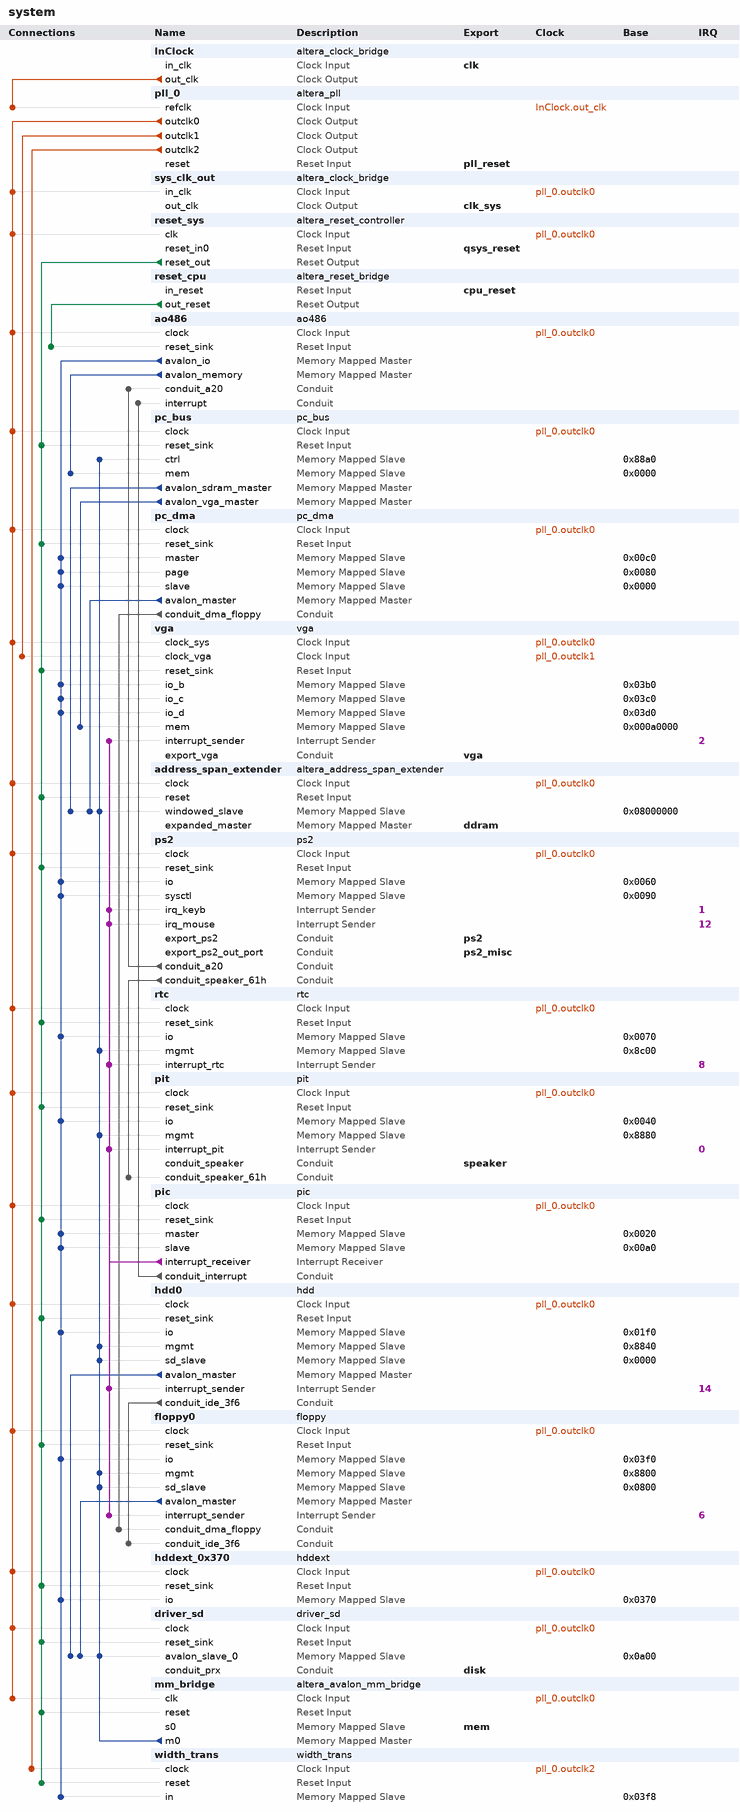
[diagram p0: system contents]
# Platform Designer (Qsys) system system, Cyclone V 5CSEMA5F31C6
# Parameters at their usual value, and those the tool derives, are not listed.
package require -exact qsys 17.0
create_system system
set_project_property DEVICE_FAMILY {Cyclone V}
set_project_property DEVICE 5CSEMA5F31C6

add_instance InClock altera_clock_bridge 17.0
set_instance_parameter_value InClock DERIVED_CLOCK_RATE 0
set_instance_parameter_value InClock EXPLICIT_CLOCK_RATE 50000000

add_instance pll_0 altera_pll 17.0
set_instance_parameter_value pll_0 gui_device_speed_grade 1
set_instance_parameter_value pll_0 gui_number_of_clocks 3
set_instance_parameter_value pll_0 gui_operation_mode direct
set_instance_parameter_value pll_0 gui_output_clock_frequency0 90.5
set_instance_parameter_value pll_0 gui_output_clock_frequency1 26.0
set_instance_parameter_value pll_0 gui_output_clock_frequency2 1.8432
set_instance_parameter_value pll_0 gui_pll_auto_reset On
set_instance_parameter_value pll_0 gui_pll_mode {Integer-N PLL}
set_instance_parameter_value pll_0 gui_reference_clock_frequency 50.0
set_instance_parameter_value pll_0 gui_use_locked false

add_instance sys_clk_out altera_clock_bridge 17.0
set_instance_parameter_value sys_clk_out DERIVED_CLOCK_RATE 90500000
set_instance_parameter_value sys_clk_out EXPLICIT_CLOCK_RATE 0

add_instance reset_sys altera_reset_controller 17.0
set_instance_parameter_value reset_sys NUM_RESET_INPUTS 1
set_instance_parameter_value reset_sys SYNC_DEPTH 2

add_instance reset_cpu altera_reset_bridge 17.0
set_instance_parameter_value reset_cpu ACTIVE_LOW_RESET 0
set_instance_parameter_value reset_cpu SYNCHRONOUS_EDGES none

add_instance ao486 ao486 1.0

add_instance pc_bus pc_bus 1.0

add_instance pc_dma pc_dma 1.0

add_instance vga vga 1.0

add_instance address_span_extender altera_address_span_extender 17.0
set_instance_parameter_value address_span_extender BURSTCOUNT_WIDTH 8
set_instance_parameter_value address_span_extender DATA_WIDTH 64
set_instance_parameter_value address_span_extender ENABLE_SLAVE_PORT false
set_instance_parameter_value address_span_extender MASTER_ADDRESS_DEF 805306368
set_instance_parameter_value address_span_extender MAX_PENDING_READS 8
set_instance_parameter_value address_span_extender SLAVE_ADDRESS_WIDTH 24

add_instance ps2 ps2 1.0

add_instance rtc rtc 1.0

add_instance pit pit 1.0

add_instance pic pic 1.0

add_instance hdd0 hdd 1.0
set_instance_parameter_value hdd0 BufAddress 0

add_instance floppy0 floppy 1.0
set_instance_parameter_value floppy0 BufAddress 2048

add_instance hddext_0x370 hddext 1.0

add_instance driver_sd driver_sd 2.0

add_instance mm_bridge altera_avalon_mm_bridge 17.0
set_instance_parameter_value mm_bridge ADDRESS_UNITS SYMBOLS
set_instance_parameter_value mm_bridge ADDRESS_WIDTH 32
set_instance_parameter_value mm_bridge DATA_WIDTH 32
set_instance_parameter_value mm_bridge MAX_PENDING_RESPONSES 4
set_instance_parameter_value mm_bridge USE_AUTO_ADDRESS_WIDTH 0

add_instance width_trans width_trans 17.0

# connections
add_connection InClock.out_clk pll_0.refclk clock
add_connection pll_0.outclk0 address_span_extender.clock clock
add_connection pll_0.outclk0 ao486.clock clock
add_connection pll_0.outclk0 driver_sd.clock clock
add_connection pll_0.outclk0 floppy0.clock clock
add_connection pll_0.outclk0 hdd0.clock clock
add_connection pll_0.outclk0 hddext_0x370.clock clock
add_connection pll_0.outclk0 mm_bridge.clk clock
add_connection pll_0.outclk0 pc_bus.clock clock
add_connection pll_0.outclk0 pc_dma.clock clock
add_connection pll_0.outclk0 pic.clock clock
add_connection pll_0.outclk0 pit.clock clock
add_connection pll_0.outclk0 ps2.clock clock
add_connection pll_0.outclk0 reset_sys.clk clock
add_connection pll_0.outclk0 rtc.clock clock
add_connection pll_0.outclk0 sys_clk_out.in_clk clock
add_connection pll_0.outclk0 vga.clock_sys clock
add_connection pll_0.outclk1 vga.clock_vga clock
add_connection pll_0.outclk2 width_trans.clock clock
add_connection reset_cpu.out_reset ao486.reset_sink reset
add_connection reset_sys.reset_out address_span_extender.reset reset
add_connection reset_sys.reset_out driver_sd.reset_sink reset
add_connection reset_sys.reset_out floppy0.reset_sink reset
add_connection reset_sys.reset_out hdd0.reset_sink reset
add_connection reset_sys.reset_out hddext_0x370.reset_sink reset
add_connection reset_sys.reset_out mm_bridge.reset reset
add_connection reset_sys.reset_out pc_bus.reset_sink reset
add_connection reset_sys.reset_out pc_dma.reset_sink reset
add_connection reset_sys.reset_out pic.reset_sink reset
add_connection reset_sys.reset_out pit.reset_sink reset
add_connection reset_sys.reset_out ps2.reset_sink reset
add_connection reset_sys.reset_out rtc.reset_sink reset
add_connection reset_sys.reset_out vga.reset_sink reset
add_connection reset_sys.reset_out width_trans.reset reset
add_connection ao486.avalon_io floppy0.io avalon
set_connection_parameter_value ao486.avalon_io/floppy0.io baseAddress 0x03f0
add_connection ao486.avalon_io hdd0.io avalon
set_connection_parameter_value ao486.avalon_io/hdd0.io baseAddress 0x01f0
add_connection ao486.avalon_io hddext_0x370.io avalon
set_connection_parameter_value ao486.avalon_io/hddext_0x370.io baseAddress 0x0370
add_connection ao486.avalon_io pc_dma.master avalon
set_connection_parameter_value ao486.avalon_io/pc_dma.master baseAddress 0x00c0
add_connection ao486.avalon_io pc_dma.page avalon
set_connection_parameter_value ao486.avalon_io/pc_dma.page baseAddress 0x0080
add_connection ao486.avalon_io pc_dma.slave avalon
set_connection_parameter_value ao486.avalon_io/pc_dma.slave baseAddress 0x0000
add_connection ao486.avalon_io pic.master avalon
set_connection_parameter_value ao486.avalon_io/pic.master baseAddress 0x0020
add_connection ao486.avalon_io pic.slave avalon
set_connection_parameter_value ao486.avalon_io/pic.slave baseAddress 0x00a0
add_connection ao486.avalon_io pit.io avalon
set_connection_parameter_value ao486.avalon_io/pit.io baseAddress 0x0040
add_connection ao486.avalon_io ps2.io avalon
set_connection_parameter_value ao486.avalon_io/ps2.io baseAddress 0x0060
add_connection ao486.avalon_io ps2.sysctl avalon
set_connection_parameter_value ao486.avalon_io/ps2.sysctl baseAddress 0x0090
add_connection ao486.avalon_io rtc.io avalon
set_connection_parameter_value ao486.avalon_io/rtc.io baseAddress 0x0070
add_connection ao486.avalon_io vga.io_b avalon
set_connection_parameter_value ao486.avalon_io/vga.io_b baseAddress 0x03b0
add_connection ao486.avalon_io vga.io_c avalon
set_connection_parameter_value ao486.avalon_io/vga.io_c baseAddress 0x03c0
add_connection ao486.avalon_io vga.io_d avalon
set_connection_parameter_value ao486.avalon_io/vga.io_d baseAddress 0x03d0
add_connection ao486.avalon_io width_trans.in avalon
set_connection_parameter_value ao486.avalon_io/width_trans.in baseAddress 0x03f8
add_connection ao486.avalon_memory pc_bus.mem avalon
set_connection_parameter_value ao486.avalon_memory/pc_bus.mem baseAddress 0x0000
add_connection floppy0.avalon_master driver_sd.avalon_slave_0 avalon
set_connection_parameter_value floppy0.avalon_master/driver_sd.avalon_slave_0 baseAddress 0x0a00
add_connection hdd0.avalon_master driver_sd.avalon_slave_0 avalon
set_connection_parameter_value hdd0.avalon_master/driver_sd.avalon_slave_0 baseAddress 0x0a00
add_connection mm_bridge.m0 address_span_extender.windowed_slave avalon
set_connection_parameter_value mm_bridge.m0/address_span_extender.windowed_slave baseAddress 0x08000000
add_connection mm_bridge.m0 driver_sd.avalon_slave_0 avalon
set_connection_parameter_value mm_bridge.m0/driver_sd.avalon_slave_0 baseAddress 0x0a00
add_connection mm_bridge.m0 floppy0.mgmt avalon
set_connection_parameter_value mm_bridge.m0/floppy0.mgmt baseAddress 0x8800
add_connection mm_bridge.m0 floppy0.sd_slave avalon
set_connection_parameter_value mm_bridge.m0/floppy0.sd_slave baseAddress 0x0800
add_connection mm_bridge.m0 hdd0.mgmt avalon
set_connection_parameter_value mm_bridge.m0/hdd0.mgmt baseAddress 0x8840
add_connection mm_bridge.m0 hdd0.sd_slave avalon
set_connection_parameter_value mm_bridge.m0/hdd0.sd_slave baseAddress 0x0000
add_connection mm_bridge.m0 pc_bus.ctrl avalon
set_connection_parameter_value mm_bridge.m0/pc_bus.ctrl baseAddress 0x88a0
add_connection mm_bridge.m0 pit.mgmt avalon
set_connection_parameter_value mm_bridge.m0/pit.mgmt baseAddress 0x8880
add_connection mm_bridge.m0 rtc.mgmt avalon
set_connection_parameter_value mm_bridge.m0/rtc.mgmt baseAddress 0x8c00
add_connection pc_bus.avalon_sdram_master address_span_extender.windowed_slave avalon
set_connection_parameter_value pc_bus.avalon_sdram_master/address_span_extender.windowed_slave baseAddress 0x08000000
add_connection pc_bus.avalon_vga_master vga.mem avalon
set_connection_parameter_value pc_bus.avalon_vga_master/vga.mem baseAddress 0x000a0000
add_connection pc_dma.avalon_master address_span_extender.windowed_slave avalon
set_connection_parameter_value pc_dma.avalon_master/address_span_extender.windowed_slave baseAddress 0x08000000
add_connection hdd0.conduit_ide_3f6 floppy0.conduit_ide_3f6 conduit
add_connection pc_dma.conduit_dma_floppy floppy0.conduit_dma_floppy conduit
add_connection pic.conduit_interrupt ao486.interrupt conduit
add_connection ps2.conduit_a20 ao486.conduit_a20 conduit
add_connection ps2.conduit_speaker_61h pit.conduit_speaker_61h conduit
add_connection pic.interrupt_receiver floppy0.interrupt_sender interrupt
set_connection_parameter_value pic.interrupt_receiver/floppy0.interrupt_sender irqNumber 6
add_connection pic.interrupt_receiver hdd0.interrupt_sender interrupt
set_connection_parameter_value pic.interrupt_receiver/hdd0.interrupt_sender irqNumber 14
add_connection pic.interrupt_receiver pit.interrupt_pit interrupt
set_connection_parameter_value pic.interrupt_receiver/pit.interrupt_pit irqNumber 0
add_connection pic.interrupt_receiver ps2.irq_keyb interrupt
set_connection_parameter_value pic.interrupt_receiver/ps2.irq_keyb irqNumber 1
add_connection pic.interrupt_receiver ps2.irq_mouse interrupt
set_connection_parameter_value pic.interrupt_receiver/ps2.irq_mouse irqNumber 12
add_connection pic.interrupt_receiver rtc.interrupt_rtc interrupt
set_connection_parameter_value pic.interrupt_receiver/rtc.interrupt_rtc irqNumber 8
add_connection pic.interrupt_receiver vga.interrupt_sender interrupt
set_connection_parameter_value pic.interrupt_receiver/vga.interrupt_sender irqNumber 2

# exported interfaces
add_interface clk clock sink
set_interface_property clk EXPORT_OF InClock.in_clk
add_interface clk_sys clock source
set_interface_property clk_sys EXPORT_OF sys_clk_out.out_clk
add_interface cpu_reset reset sink
set_interface_property cpu_reset EXPORT_OF reset_cpu.in_reset
add_interface ddram avalon master
set_interface_property ddram EXPORT_OF address_span_extender.expanded_master
add_interface disk conduit end
set_interface_property disk EXPORT_OF driver_sd.conduit_prx
add_interface mem avalon slave
set_interface_property mem EXPORT_OF mm_bridge.s0
add_interface pll_reset reset sink
set_interface_property pll_reset EXPORT_OF pll_0.reset
add_interface ps2 conduit end
set_interface_property ps2 EXPORT_OF ps2.export_ps2
add_interface ps2_misc conduit end
set_interface_property ps2_misc EXPORT_OF ps2.export_ps2_out_port
add_interface qsys_reset reset sink
set_interface_property qsys_reset EXPORT_OF reset_sys.reset_in0
add_interface speaker conduit end
set_interface_property speaker EXPORT_OF pit.conduit_speaker
add_interface vga conduit end
set_interface_property vga EXPORT_OF vga.export_vga

set_interconnect_requirement {$system} qsys_mm.clockCrossingAdapter HANDSHAKE
set_interconnect_requirement {$system} qsys_mm.maxAdditionalLatency 0

save_system system.qsys
